# Altium schematic sheet Stub Termination.SchDoc
size A3
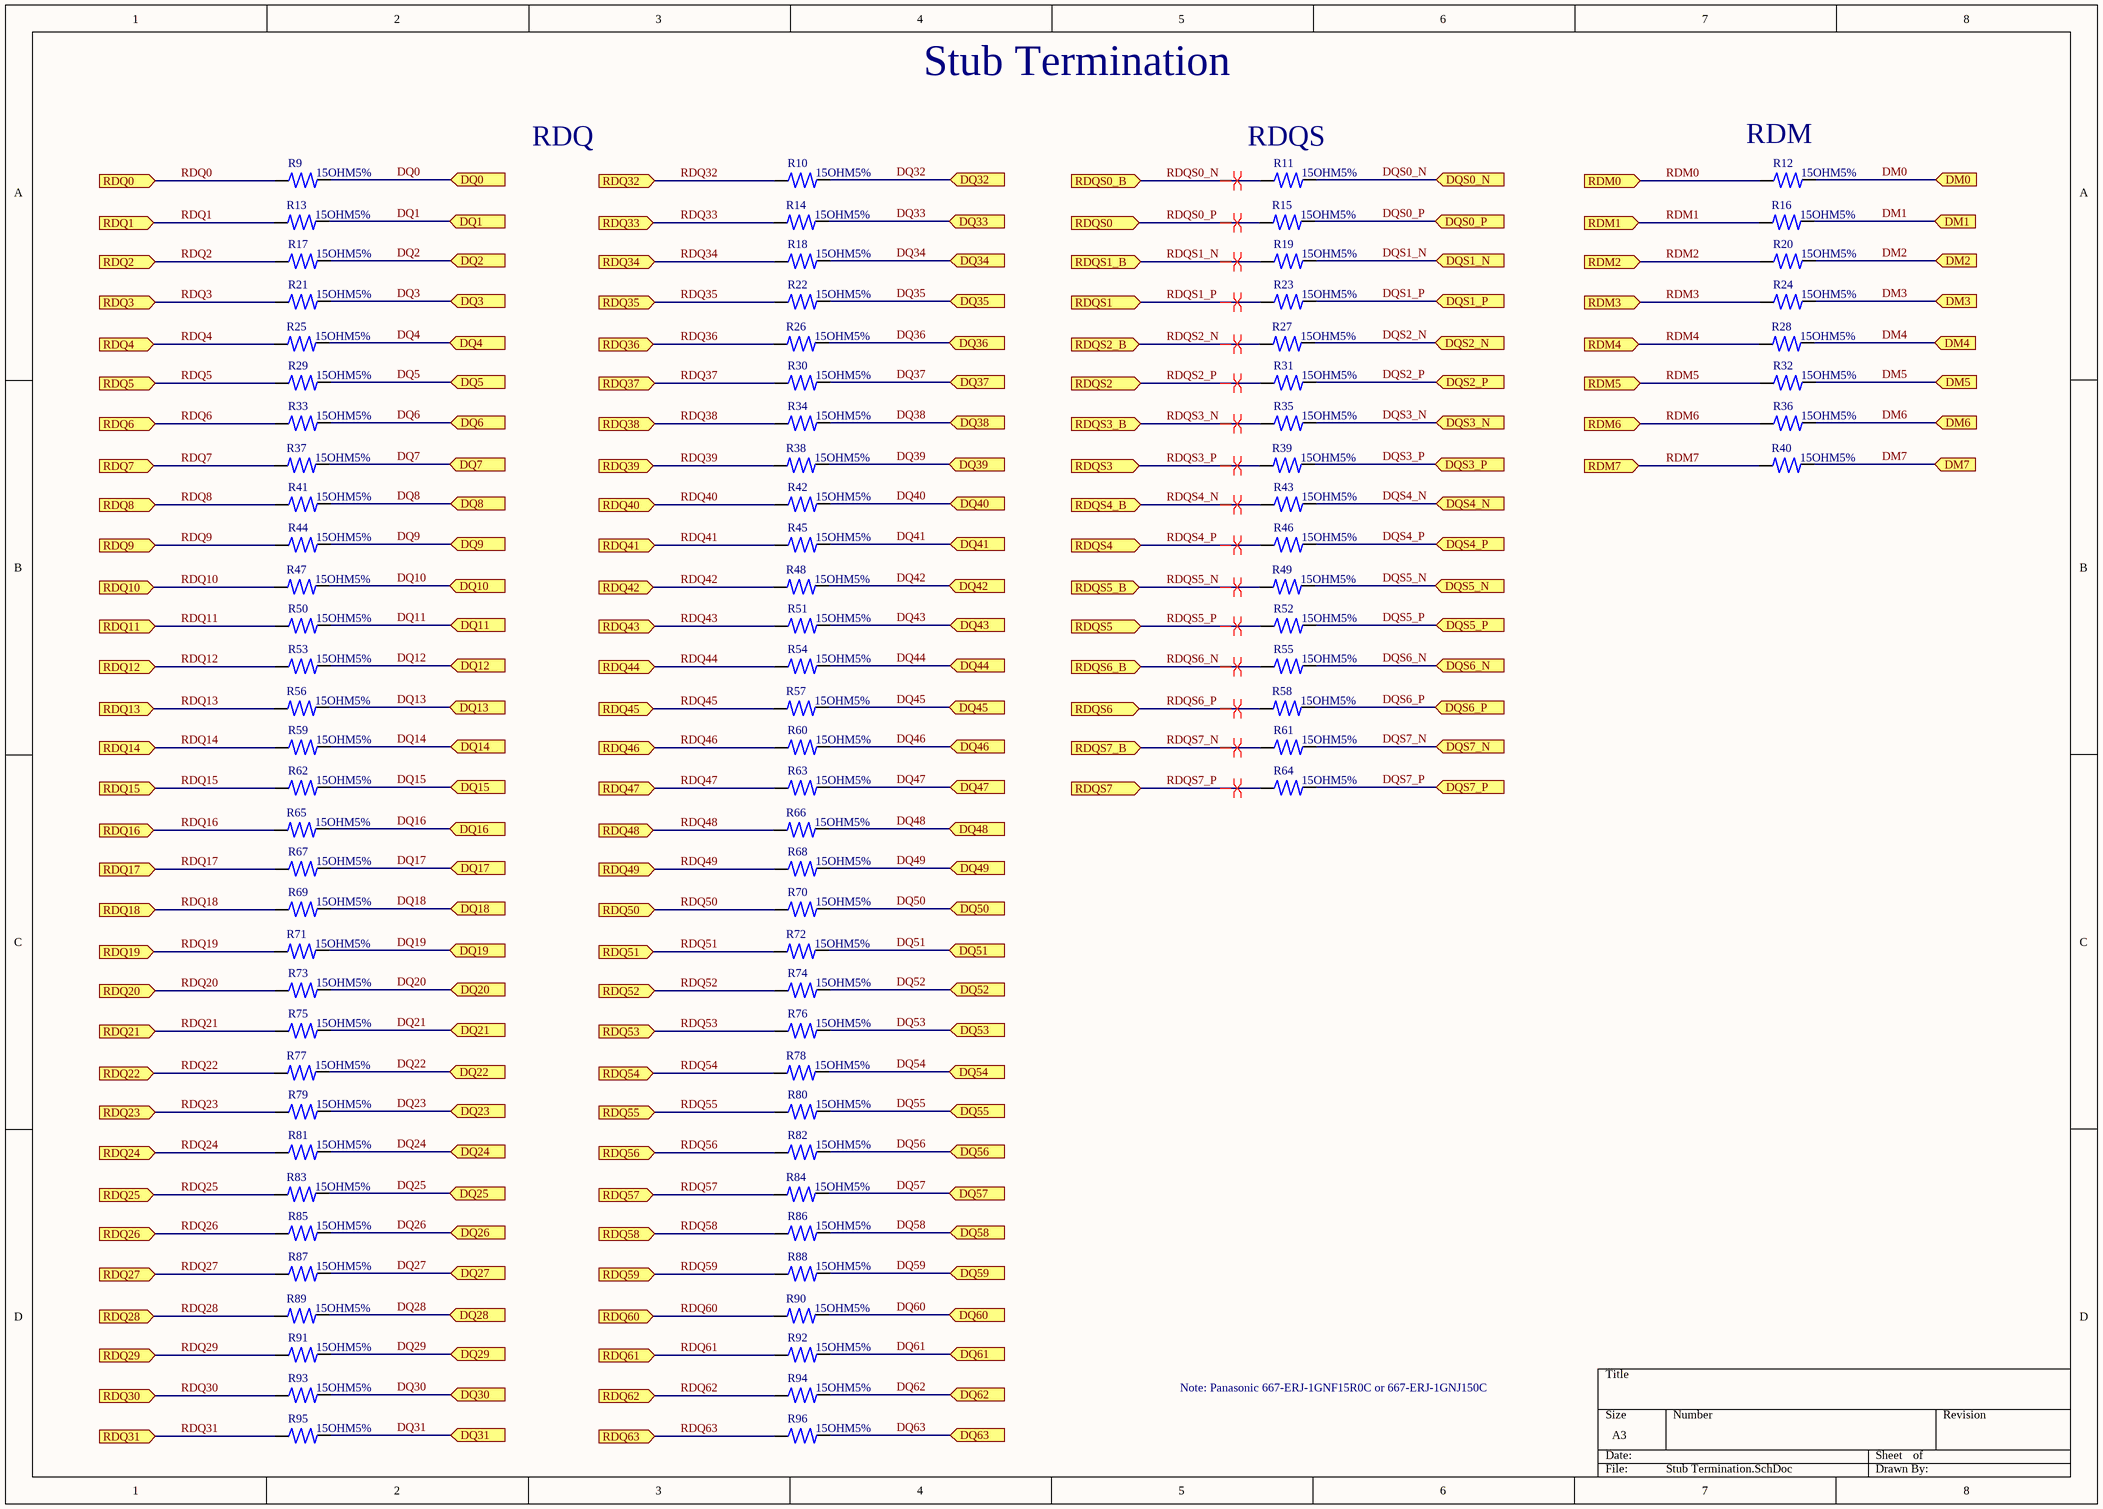
[diagram p0: Stub Termination.SchDoc]

## Parts
R9  Resistance: 15OHM5%  [Resistor 0402]  (hidden comment: Resistor 0402)
R10  Resistance: 15OHM5%  [Resistor 0402]  (hidden comment: Resistor 0402)
R11  Resistance: 15OHM5%  [Resistor 0402]  (hidden comment: Resistor 0402)
R12  Resistance: 15OHM5%  [Resistor 0402]  (hidden comment: Resistor 0402)
R13  Resistance: 15OHM5%  [Resistor 0402]  (hidden comment: Resistor 0402)
R14  Resistance: 15OHM5%  [Resistor 0402]  (hidden comment: Resistor 0402)
R15  Resistance: 15OHM5%  [Resistor 0402]  (hidden comment: Resistor 0402)
R16  Resistance: 15OHM5%  [Resistor 0402]  (hidden comment: Resistor 0402)
R17  Resistance: 15OHM5%  [Resistor 0402]  (hidden comment: Resistor 0402)
R18  Resistance: 15OHM5%  [Resistor 0402]  (hidden comment: Resistor 0402)
R19  Resistance: 15OHM5%  [Resistor 0402]  (hidden comment: Resistor 0402)
R20  Resistance: 15OHM5%  [Resistor 0402]  (hidden comment: Resistor 0402)
R21  Resistance: 15OHM5%  [Resistor 0402]  (hidden comment: Resistor 0402)
R22  Resistance: 15OHM5%  [Resistor 0402]  (hidden comment: Resistor 0402)
R23  Resistance: 15OHM5%  [Resistor 0402]  (hidden comment: Resistor 0402)
R24  Resistance: 15OHM5%  [Resistor 0402]  (hidden comment: Resistor 0402)
R25  Resistance: 15OHM5%  [Resistor 0402]  (hidden comment: Resistor 0402)
R26  Resistance: 15OHM5%  [Resistor 0402]  (hidden comment: Resistor 0402)
R27  Resistance: 15OHM5%  [Resistor 0402]  (hidden comment: Resistor 0402)
R28  Resistance: 15OHM5%  [Resistor 0402]  (hidden comment: Resistor 0402)
R29  Resistance: 15OHM5%  [Resistor 0402]  (hidden comment: Resistor 0402)
R30  Resistance: 15OHM5%  [Resistor 0402]  (hidden comment: Resistor 0402)
R31  Resistance: 15OHM5%  [Resistor 0402]  (hidden comment: Resistor 0402)
R32  Resistance: 15OHM5%  [Resistor 0402]  (hidden comment: Resistor 0402)
R33  Resistance: 15OHM5%  [Resistor 0402]  (hidden comment: Resistor 0402)
R34  Resistance: 15OHM5%  [Resistor 0402]  (hidden comment: Resistor 0402)
R35  Resistance: 15OHM5%  [Resistor 0402]  (hidden comment: Resistor 0402)
R36  Resistance: 15OHM5%  [Resistor 0402]  (hidden comment: Resistor 0402)
R37  Resistance: 15OHM5%  [Resistor 0402]  (hidden comment: Resistor 0402)
R38  Resistance: 15OHM5%  [Resistor 0402]  (hidden comment: Resistor 0402)
R39  Resistance: 15OHM5%  [Resistor 0402]  (hidden comment: Resistor 0402)
R40  Resistance: 15OHM5%  [Resistor 0402]  (hidden comment: Resistor 0402)
R41  Resistance: 15OHM5%  [Resistor 0402]  (hidden comment: Resistor 0402)
R42  Resistance: 15OHM5%  [Resistor 0402]  (hidden comment: Resistor 0402)
R43  Resistance: 15OHM5%  [Resistor 0402]  (hidden comment: Resistor 0402)
R44  Resistance: 15OHM5%  [Resistor 0402]  (hidden comment: Resistor 0402)
R45  Resistance: 15OHM5%  [Resistor 0402]  (hidden comment: Resistor 0402)
R46  Resistance: 15OHM5%  [Resistor 0402]  (hidden comment: Resistor 0402)
R47  Resistance: 15OHM5%  [Resistor 0402]  (hidden comment: Resistor 0402)
R48  Resistance: 15OHM5%  [Resistor 0402]  (hidden comment: Resistor 0402)
R49  Resistance: 15OHM5%  [Resistor 0402]  (hidden comment: Resistor 0402)
R50  Resistance: 15OHM5%  [Resistor 0402]  (hidden comment: Resistor 0402)
R51  Resistance: 15OHM5%  [Resistor 0402]  (hidden comment: Resistor 0402)
R52  Resistance: 15OHM5%  [Resistor 0402]  (hidden comment: Resistor 0402)
R53  Resistance: 15OHM5%  [Resistor 0402]  (hidden comment: Resistor 0402)
R54  Resistance: 15OHM5%  [Resistor 0402]  (hidden comment: Resistor 0402)
R55  Resistance: 15OHM5%  [Resistor 0402]  (hidden comment: Resistor 0402)
R56  Resistance: 15OHM5%  [Resistor 0402]  (hidden comment: Resistor 0402)
R57  Resistance: 15OHM5%  [Resistor 0402]  (hidden comment: Resistor 0402)
R58  Resistance: 15OHM5%  [Resistor 0402]  (hidden comment: Resistor 0402)
R59  Resistance: 15OHM5%  [Resistor 0402]  (hidden comment: Resistor 0402)
R60  Resistance: 15OHM5%  [Resistor 0402]  (hidden comment: Resistor 0402)
R61  Resistance: 15OHM5%  [Resistor 0402]  (hidden comment: Resistor 0402)
R62  Resistance: 15OHM5%  [Resistor 0402]  (hidden comment: Resistor 0402)
R63  Resistance: 15OHM5%  [Resistor 0402]  (hidden comment: Resistor 0402)
R64  Resistance: 15OHM5%  [Resistor 0402]  (hidden comment: Resistor 0402)
R65  Resistance: 15OHM5%  [Resistor 0402]  (hidden comment: Resistor 0402)
R66  Resistance: 15OHM5%  [Resistor 0402]  (hidden comment: Resistor 0402)
R67  Resistance: 15OHM5%  [Resistor 0402]  (hidden comment: Resistor 0402)
R68  Resistance: 15OHM5%  [Resistor 0402]  (hidden comment: Resistor 0402)
R69  Resistance: 15OHM5%  [Resistor 0402]  (hidden comment: Resistor 0402)
R70  Resistance: 15OHM5%  [Resistor 0402]  (hidden comment: Resistor 0402)
R71  Resistance: 15OHM5%  [Resistor 0402]  (hidden comment: Resistor 0402)
R72  Resistance: 15OHM5%  [Resistor 0402]  (hidden comment: Resistor 0402)
R73  Resistance: 15OHM5%  [Resistor 0402]  (hidden comment: Resistor 0402)
R74  Resistance: 15OHM5%  [Resistor 0402]  (hidden comment: Resistor 0402)
R75  Resistance: 15OHM5%  [Resistor 0402]  (hidden comment: Resistor 0402)
R76  Resistance: 15OHM5%  [Resistor 0402]  (hidden comment: Resistor 0402)
R77  Resistance: 15OHM5%  [Resistor 0402]  (hidden comment: Resistor 0402)
R78  Resistance: 15OHM5%  [Resistor 0402]  (hidden comment: Resistor 0402)
R79  Resistance: 15OHM5%  [Resistor 0402]  (hidden comment: Resistor 0402)
R80  Resistance: 15OHM5%  [Resistor 0402]  (hidden comment: Resistor 0402)
R81  Resistance: 15OHM5%  [Resistor 0402]  (hidden comment: Resistor 0402)
R82  Resistance: 15OHM5%  [Resistor 0402]  (hidden comment: Resistor 0402)
R83  Resistance: 15OHM5%  [Resistor 0402]  (hidden comment: Resistor 0402)
R84  Resistance: 15OHM5%  [Resistor 0402]  (hidden comment: Resistor 0402)
R85  Resistance: 15OHM5%  [Resistor 0402]  (hidden comment: Resistor 0402)
R86  Resistance: 15OHM5%  [Resistor 0402]  (hidden comment: Resistor 0402)
R87  Resistance: 15OHM5%  [Resistor 0402]  (hidden comment: Resistor 0402)
R88  Resistance: 15OHM5%  [Resistor 0402]  (hidden comment: Resistor 0402)
R89  Resistance: 15OHM5%  [Resistor 0402]  (hidden comment: Resistor 0402)
R90  Resistance: 15OHM5%  [Resistor 0402]  (hidden comment: Resistor 0402)
R91  Resistance: 15OHM5%  [Resistor 0402]  (hidden comment: Resistor 0402)
R92  Resistance: 15OHM5%  [Resistor 0402]  (hidden comment: Resistor 0402)
R93  Resistance: 15OHM5%  [Resistor 0402]  (hidden comment: Resistor 0402)
R94  Resistance: 15OHM5%  [Resistor 0402]  (hidden comment: Resistor 0402)
R95  Resistance: 15OHM5%  [Resistor 0402]  (hidden comment: Resistor 0402)
R96  Resistance: 15OHM5%  [Resistor 0402]  (hidden comment: Resistor 0402)

## Ports
DM0 (in), DM1 (in), DM2 (in), DM3 (in), DM4 (in), DM5 (in), DM6 (in), DM7 (in), DQ0 (in), DQ1 (in), DQ2 (in), DQ3 (in), DQ4 (in), DQ5 (in), DQ6 (in), DQ7 (in), DQ8 (in), DQ9 (in), DQ10 (in), DQ11 (in), DQ12 (in), DQ13 (in), DQ14 (in), DQ15 (in), DQ16 (in), DQ17 (in), DQ18 (in), DQ19 (in), DQ20 (in), DQ21 (in), DQ22 (in), DQ23 (in), DQ24 (in), DQ25 (in), DQ26 (in), DQ27 (in), DQ28 (in), DQ29 (in), DQ30 (in), DQ31 (in), DQ32 (in), DQ33 (in), DQ34 (in), DQ35 (in), DQ36 (in), DQ37 (in), DQ38 (in), DQ39 (in), DQ40 (in), DQ41 (in), DQ42 (in), DQ43 (in), DQ44 (in), DQ45 (in), DQ46 (in), DQ47 (in), DQ48 (in), DQ49 (in), DQ50 (in), DQ51 (in), DQ52 (in), DQ53 (in), DQ54 (in), DQ55 (in), DQ56 (in), DQ57 (in), DQ58 (in), DQ59 (in), DQ60 (in), DQ61 (in), DQ62 (in), DQ63 (in), DQS0_N (in), DQS0_P (in), DQS1_N (in), DQS1_P (in), DQS2_N (in), DQS2_P (in), DQS3_N (in), DQS3_P (in), DQS4_N (in), DQS4_P (in), DQS5_N (in), DQS5_P (in), DQS6_N (in), DQS6_P (in), DQS7_N (in), DQS7_P (in), RDM0 (in), RDM1 (in), RDM2 (in), RDM3 (in), RDM4 (in), RDM5 (in), RDM6 (in), RDM7 (in), RDQ0 (in), RDQ1 (in), RDQ2 (in), RDQ3 (in), RDQ4 (in), RDQ5 (in), RDQ6 (in), RDQ7 (in), RDQ8 (in), RDQ9 (in), RDQ10 (in), RDQ11 (in), RDQ12 (in), RDQ13 (in), RDQ14 (in), RDQ15 (in), RDQ16 (in), RDQ17 (in), RDQ18 (in), RDQ19 (in), RDQ20 (in), RDQ21 (in), RDQ22 (in), RDQ23 (in), RDQ24 (in), RDQ25 (in), RDQ26 (in), RDQ27 (in), RDQ28 (in), RDQ29 (in), RDQ30 (in), RDQ31 (in), RDQ32 (in), RDQ33 (in), RDQ34 (in), RDQ35 (in), RDQ36 (in), RDQ37 (in), RDQ38 (in), RDQ39 (in), RDQ40 (in), RDQ41 (in), RDQ42 (in), RDQ43 (in), RDQ44 (in), RDQ45 (in), RDQ46 (in), RDQ47 (in), RDQ48 (in), RDQ49 (in), RDQ50 (in), RDQ51 (in), RDQ52 (in), RDQ53 (in), RDQ54 (in), RDQ55 (in), RDQ56 (in), RDQ57 (in), RDQ58 (in), RDQ59 (in), RDQ60 (in), RDQ61 (in), RDQ62 (in), RDQ63 (in), RDQS0 (in), RDQS0_B (in), RDQS1 (in), RDQS1_B (in), RDQS2 (in), RDQS2_B (in), RDQS3 (in), RDQS3_B (in), RDQS4 (in), RDQS4_B (in), RDQS5 (in), RDQS5_B (in), RDQS6 (in), RDQS6_B (in), RDQS7 (in), RDQS7_B (in)

## Nets
DM0: R12.2 ; port DM0
DM1: R16.2 ; port DM1
DM2: R20.2 ; port DM2
DM3: R24.2 ; port DM3
DM4: R28.2 ; port DM4
DM5: R32.2 ; port DM5
DM6: R36.2 ; port DM6
DM7: R40.2 ; port DM7
DQ0: R9.2 ; port DQ0
DQ1: R13.2 ; port DQ1
DQ2: R17.2 ; port DQ2
DQ3: R21.2 ; port DQ3
DQ4: R25.2 ; port DQ4
DQ5: R29.2 ; port DQ5
DQ6: R33.2 ; port DQ6
DQ7: R37.2 ; port DQ7
DQ8: R41.2 ; port DQ8
DQ9: R44.2 ; port DQ9
DQ10: R47.2 ; port DQ10
DQ11: R50.2 ; port DQ11
DQ12: R53.2 ; port DQ12
DQ13: R56.2 ; port DQ13
DQ14: R59.2 ; port DQ14
DQ15: R62.2 ; port DQ15
DQ16: R65.2 ; port DQ16
DQ17: R67.2 ; port DQ17
DQ18: R69.2 ; port DQ18
DQ19: R71.2 ; port DQ19
DQ20: R73.2 ; port DQ20
DQ21: R75.2 ; port DQ21
DQ22: R77.2 ; port DQ22
DQ23: R79.2 ; port DQ23
DQ24: R81.2 ; port DQ24
DQ25: R83.2 ; port DQ25
DQ26: R85.2 ; port DQ26
DQ27: R87.2 ; port DQ27
DQ28: R89.2 ; port DQ28
DQ29: R91.2 ; port DQ29
DQ30: R93.2 ; port DQ30
DQ31: R95.2 ; port DQ31
DQ32: R10.2 ; port DQ32
DQ33: R14.2 ; port DQ33
DQ34: R18.2 ; port DQ34
DQ35: R22.2 ; port DQ35
DQ36: R26.2 ; port DQ36
DQ37: R30.2 ; port DQ37
DQ38: R34.2 ; port DQ38
DQ39: R38.2 ; port DQ39
DQ40: R42.2 ; port DQ40
DQ41: R45.2 ; port DQ41
DQ42: R48.2 ; port DQ42
DQ43: R51.2 ; port DQ43
DQ44: R54.2 ; port DQ44
DQ45: R57.2 ; port DQ45
DQ46: R60.2 ; port DQ46
DQ47: R63.2 ; port DQ47
DQ48: R66.2 ; port DQ48
DQ49: R68.2 ; port DQ49
DQ50: R70.2 ; port DQ50
DQ51: R72.2 ; port DQ51
DQ52: R74.2 ; port DQ52
DQ53: R76.2 ; port DQ53
DQ54: R78.2 ; port DQ54
DQ55: R80.2 ; port DQ55
DQ56: R82.2 ; port DQ56
DQ57: R84.2 ; port DQ57
DQ58: R86.2 ; port DQ58
DQ59: R88.2 ; port DQ59
DQ60: R90.2 ; port DQ60
DQ61: R92.2 ; port DQ61
DQ62: R94.2 ; port DQ62
DQ63: R96.2 ; port DQ63
DQS0_N: R11.2 ; port DQS0_N
DQS0_P: R15.2 ; port DQS0_P
DQS1_N: R19.2 ; port DQS1_N
DQS1_P: R23.2 ; port DQS1_P
DQS2_N: R27.2 ; port DQS2_N
DQS2_P: R31.2 ; port DQS2_P
DQS3_N: R35.2 ; port DQS3_N
DQS3_P: R39.2 ; port DQS3_P
DQS4_N: R43.2 ; port DQS4_N
DQS4_P: R46.2 ; port DQS4_P
DQS5_N: R49.2 ; port DQS5_N
DQS5_P: R52.2 ; port DQS5_P
DQS6_N: R55.2 ; port DQS6_N
DQS6_P: R58.2 ; port DQS6_P
DQS7_N: R61.2 ; port DQS7_N
DQS7_P: R64.2 ; port DQS7_P
RDM0: R12.1 ; port RDM0
RDM1: R16.1 ; port RDM1
RDM2: R20.1 ; port RDM2
RDM3: R24.1 ; port RDM3
RDM4: R28.1 ; port RDM4
RDM5: R32.1 ; port RDM5
RDM6: R36.1 ; port RDM6
RDM7: R40.1 ; port RDM7
RDQ0: R9.1 ; port RDQ0
RDQ1: R13.1 ; port RDQ1
RDQ2: R17.1 ; port RDQ2
RDQ3: R21.1 ; port RDQ3
RDQ4: R25.1 ; port RDQ4
RDQ5: R29.1 ; port RDQ5
RDQ6: R33.1 ; port RDQ6
RDQ7: R37.1 ; port RDQ7
RDQ8: R41.1 ; port RDQ8
RDQ9: R44.1 ; port RDQ9
RDQ10: R47.1 ; port RDQ10
RDQ11: R50.1 ; port RDQ11
RDQ12: R53.1 ; port RDQ12
RDQ13: R56.1 ; port RDQ13
RDQ14: R59.1 ; port RDQ14
RDQ15: R62.1 ; port RDQ15
RDQ16: R65.1 ; port RDQ16
RDQ17: R67.1 ; port RDQ17
RDQ18: R69.1 ; port RDQ18
RDQ19: R71.1 ; port RDQ19
RDQ20: R73.1 ; port RDQ20
RDQ21: R75.1 ; port RDQ21
RDQ22: R77.1 ; port RDQ22
RDQ23: R79.1 ; port RDQ23
RDQ24: R81.1 ; port RDQ24
RDQ25: R83.1 ; port RDQ25
RDQ26: R85.1 ; port RDQ26
RDQ27: R87.1 ; port RDQ27
RDQ28: R89.1 ; port RDQ28
RDQ29: R91.1 ; port RDQ29
RDQ30: R93.1 ; port RDQ30
RDQ31: R95.1 ; port RDQ31
RDQ32: R10.1 ; port RDQ32
RDQ33: R14.1 ; port RDQ33
RDQ34: R18.1 ; port RDQ34
RDQ35: R22.1 ; port RDQ35
RDQ36: R26.1 ; port RDQ36
RDQ37: R30.1 ; port RDQ37
RDQ38: R34.1 ; port RDQ38
RDQ39: R38.1 ; port RDQ39
RDQ40: R42.1 ; port RDQ40
RDQ41: R45.1 ; port RDQ41
RDQ42: R48.1 ; port RDQ42
RDQ43: R51.1 ; port RDQ43
RDQ44: R54.1 ; port RDQ44
RDQ45: R57.1 ; port RDQ45
RDQ46: R60.1 ; port RDQ46
RDQ47: R63.1 ; port RDQ47
RDQ48: R66.1 ; port RDQ48
RDQ49: R68.1 ; port RDQ49
RDQ50: R70.1 ; port RDQ50
RDQ51: R72.1 ; port RDQ51
RDQ52: R74.1 ; port RDQ52
RDQ53: R76.1 ; port RDQ53
RDQ54: R78.1 ; port RDQ54
RDQ55: R80.1 ; port RDQ55
RDQ56: R82.1 ; port RDQ56
RDQ57: R84.1 ; port RDQ57
RDQ58: R86.1 ; port RDQ58
RDQ59: R88.1 ; port RDQ59
RDQ60: R90.1 ; port RDQ60
RDQ61: R92.1 ; port RDQ61
RDQ62: R94.1 ; port RDQ62
RDQ63: R96.1 ; port RDQ63
RDQS0_N: R11.1 ; port RDQS0_B
RDQS0_P: R15.1 ; port RDQS0
RDQS1_N: R19.1 ; port RDQS1_B
RDQS1_P: R23.1 ; port RDQS1
RDQS2_N: R27.1 ; port RDQS2_B
RDQS2_P: R31.1 ; port RDQS2
RDQS3_N: R35.1 ; port RDQS3_B
RDQS3_P: R39.1 ; port RDQS3
RDQS4_N: R43.1 ; port RDQS4_B
RDQS4_P: R46.1 ; port RDQS4
RDQS5_N: R49.1 ; port RDQS5_B
RDQS5_P: R52.1 ; port RDQS5
RDQS6_N: R55.1 ; port RDQS6_B
RDQS6_P: R58.1 ; port RDQS6
RDQS7_N: R61.1 ; port RDQS7_B
RDQS7_P: R64.1 ; port RDQS7

## Layout directives
differential pair: RDQS0_N, RDQS0_P, RDQS1_N, RDQS1_P, RDQS2_N, RDQS2_P, RDQS3_N, RDQS3_P, RDQS4_N, RDQS4_P, RDQS5_N, RDQS5_P, RDQS6_N, RDQS6_P, RDQS7_N, RDQS7_P

## Notes on the sheet
- Stub Termination
- RDQ
- (near R11) RDQS
- (near R12) RDM
- Note: Panasonic 667-ERJ-1GNF15R0C or 667-ERJ-1GNJ150C

## Library data of the parts
R9-R96 = Resistor 0201: Manufacturer: Vishay; Manufacturer Part Number: CRCW060310K0FKEA; Max Power Dissipation: 100mW; Tolerance: 1%; Voltage Rating: 75V; Temperature Coefficient: 100ppm/°C; Supplier 1: Avnet Europe; Stock 1: 305000; Pricing 1: 5000=0.00444, 10000=0.00432, 20000=0.00421, 30000=0.0041, 40000=0.004 (EUR); Case/Package: 0201; Number of Pins: 2; Weight: 7.1E-05oz; Contact Plating: Tin,Lead; Case Code (Metric): 0603; Case Code (Imperial): 0201; Min Operating Temperature: -55°C; Max Operating Temperature: 155°C; Packaging: Tape and Reel; Package Quantity: 10; Termination: SMD/SMT; Power Rating: 100mW; Composition: Thick Film; Number of Terminations: 2; Military Standard: Not; Voltage Rating (DC): 75V; Features: Automotive AEC-Q200; Length: 1.55mm; Height: 0.45mm; Width: 0.033inch; Depth: 0.85mm; Radiation Hardening: No; REACH SVHC: Unknown; Lead Free: Lead Free; ComponentLink1URL: http://www.vishay.com/docs/20008/dcrcw.pdf?src-supplier=Avnet+Europe; ComponentLink1Description: http://www.vishay.com/docs/20008/dcrcw.pdf?src-supplier=Avnet+Europe; ComponentLink2URL: https://www.verical.com/server-webapp/html/getDatasheet?partID=86831&src-supplier=Verical; ComponentLink2Description: https://www.verical.com/server-webapp/html/getDatasheet?partID=86831&src-supplier=Verical; ComponentLink3URL: http://www.farnell.com/datasheets/2310790.pdf?src-supplier=Allied+Electronics; ComponentLink3Description: http://www.farnell.com/datasheets/2310790.pdf?src-supplier=Allied+Electronics; ComponentLink4URL: http://www.vishay.com/docs/20035/dcrcwe3.pdf?src-supplier=Digi-Key; ComponentLink4Description: http://www.vishay.com/docs/20035/dcrcwe3.pdf?src-supplier=Digi-Key; ComponentLink5URL: http://www.farnell.com/datasheets/2310790.pdf?src-supplier=Mouser; ComponentLink5Description: http://www.farnell.com/datasheets/2310790.pdf?src-supplier=Mouser; ComponentLink6URL: http://www.farnell.com/datasheets/2310790.pdf?src-supplier=Element14; ComponentLink6Description: http://www.farnell.com/datasheets/2310790.pdf?src-supplier=Element14; ComponentLink7URL: http://www.farnell.com/datasheets/2310790.pdf?src-supplier=Avnet; ComponentLink7Description: http://www.farnell.com/datasheets/2310790.pdf?src-supplier=Avnet; ComponentLink8URL: http://www.vishay.com/docs/20035/dcrcwe3.pdf?src-supplier=Future+Electronics; ComponentLink8Description: http://www.vishay.com/docs/20035/dcrcwe3.pdf?src-supplier=Future+Electronics; ComponentLink9URL: http://uk.rs-online.com/webdocs/0d98/0900766b80d98afc.pdf?src-supplier=RSComponents; ComponentLink9Description: http://uk.rs-online.com/webdocs/0d98/0900766b80d98afc.pdf?src-supplier=RSComponents; ComponentLink10URL: http://www.farnell.com/datasheets/2310790.pdf?src-supplier=Distrelec; ComponentLink10Description: http://www.farnell.com/datasheets/2310790.pdf?src-supplier=Distrelec